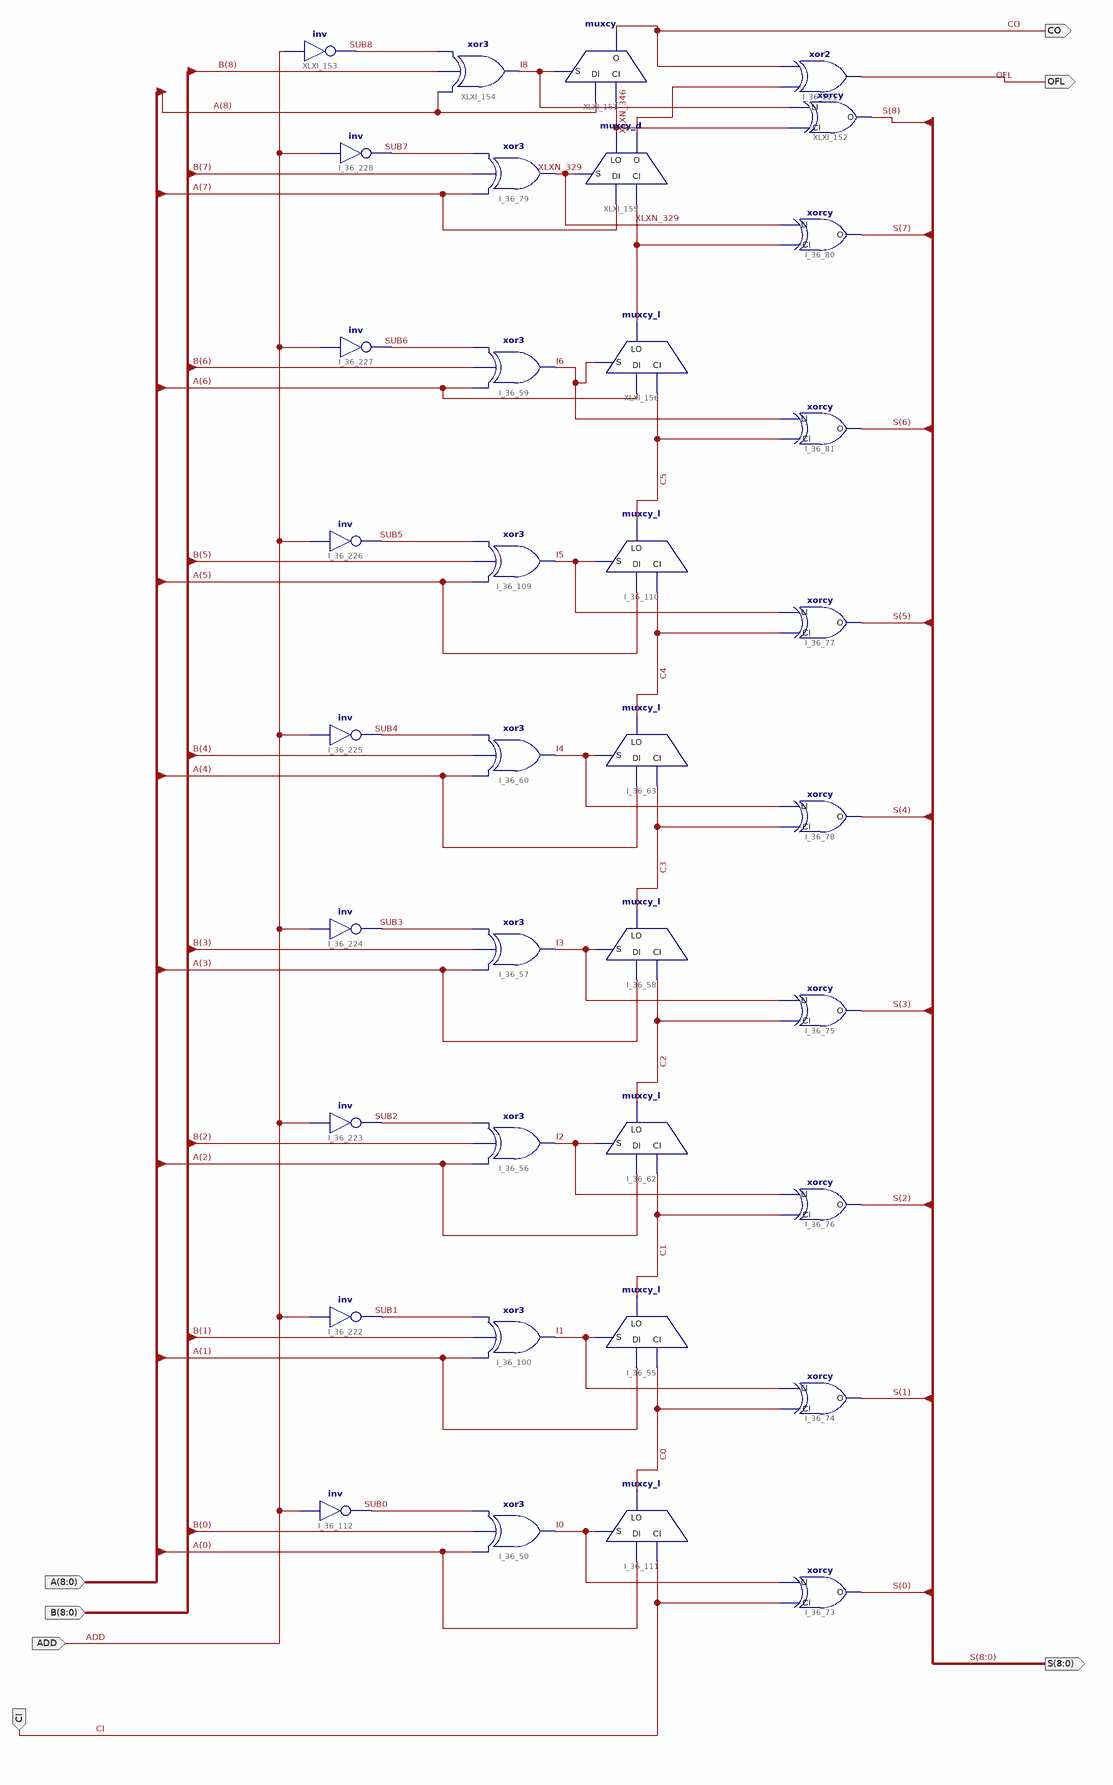
[diagram p0: schematic sheet 1]
// Xilinx ISE schematic sub9bit.sch (spartan3e) as structural Verilog: 37 symbols, 7 ports
module sub9bit (
  input  [8:0] A,
  input  [8:0] B,
  input  CI,
  input  ADD,
  output [8:0] S,
  output OFL,
  output CO
);

  wire C0, C1, C2, C3, C4, C5, C6, C6O, I0, I1, I2, I3, I4, I5, I6, I8, SUB0, SUB1, SUB2, SUB3, SUB4, SUB5,
       SUB6, SUB7, SUB8, XLXN_329, XLXN_346;

  xor I_36_221 (OFL, C6O, CO);
  xorcy I_36_73 (.CI(CI), .LI(I0), .O(S[0]));
  xorcy I_36_74 (.CI(C0), .LI(I1), .O(S[1]));
  xorcy I_36_76 (.CI(C1), .LI(I2), .O(S[2]));
  xorcy I_36_75 (.CI(C2), .LI(I3), .O(S[3]));
  xorcy I_36_78 (.CI(C3), .LI(I4), .O(S[4]));
  xorcy I_36_77 (.CI(C4), .LI(I5), .O(S[5]));
  xorcy I_36_81 (.CI(C5), .LI(I6), .O(S[6]));
  xorcy I_36_80 (.CI(C6), .LI(XLXN_329), .O(S[7]));
  not I_36_228 (SUB7, ADD);
  not I_36_227 (SUB6, ADD);
  not I_36_226 (SUB5, ADD);
  not I_36_225 (SUB4, ADD);
  not I_36_224 (SUB3, ADD);
  not I_36_223 (SUB2, ADD);
  not I_36_222 (SUB1, ADD);
  not I_36_112 (SUB0, ADD);
  muxcy_l #(.RLOC("X1Y0")) I_36_111 (.CI(CI), .DI(A[0]), .S(I0), .LO(C0));
  muxcy_l #(.RLOC("X1Y0")) I_36_55 (.CI(C0), .DI(A[1]), .S(I1), .LO(C1));
  muxcy_l #(.RLOC("X1Y1")) I_36_62 (.CI(C1), .DI(A[2]), .S(I2), .LO(C2));
  muxcy_l #(.RLOC("X1Y1")) I_36_58 (.CI(C2), .DI(A[3]), .S(I3), .LO(C3));
  muxcy_l #(.RLOC("X1Y2")) I_36_110 (.CI(C4), .DI(A[5]), .S(I5), .LO(C5));
  muxcy_l #(.RLOC("X1Y2")) I_36_63 (.CI(C3), .DI(A[4]), .S(I4), .LO(C4));
  xor I_36_109 (I5, A[5], B[5], SUB5);
  xor I_36_100 (I1, A[1], B[1], SUB1);
  xor I_36_79 (XLXN_329, A[7], B[7], SUB7);
  xor I_36_60 (I4, A[4], B[4], SUB4);
  xor I_36_59 (I6, A[6], B[6], SUB6);
  xor I_36_57 (I3, A[3], B[3], SUB3);
  xor I_36_50 (I0, A[0], B[0], SUB0);
  xor I_36_56 (I2, A[2], B[2], SUB2);
  muxcy #(.RLOC("X1Y3")) XLXI_151 (.CI(XLXN_346), .DI(A[8]), .S(I8), .O(CO));
  not XLXI_153 (SUB8, ADD);
  muxcy_d #(.RLOC("X1Y3")) XLXI_155 (.CI(C6), .DI(A[7]), .S(XLXN_329), .LO(XLXN_346), .O(C6O));
  muxcy_l #(.RLOC("X1Y2")) XLXI_156 (.CI(C5), .DI(A[6]), .S(I6), .LO(C6));
  xorcy XLXI_152 (.CI(XLXN_346), .LI(I8), .O(S[8]));
  xor XLXI_154 (I8, A[8], B[8], SUB8);
endmodule
